# EasyEDA Pro project Modular-Analog-Synthesizer.eprj, board VCA-PCB
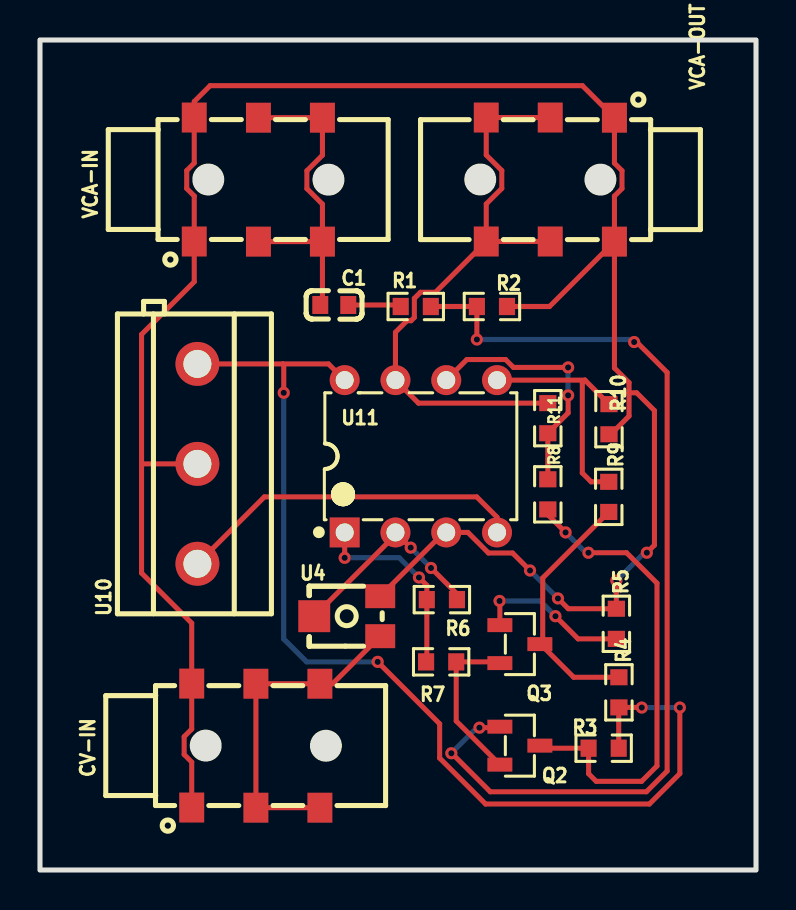
[diagram p9: board, top side]
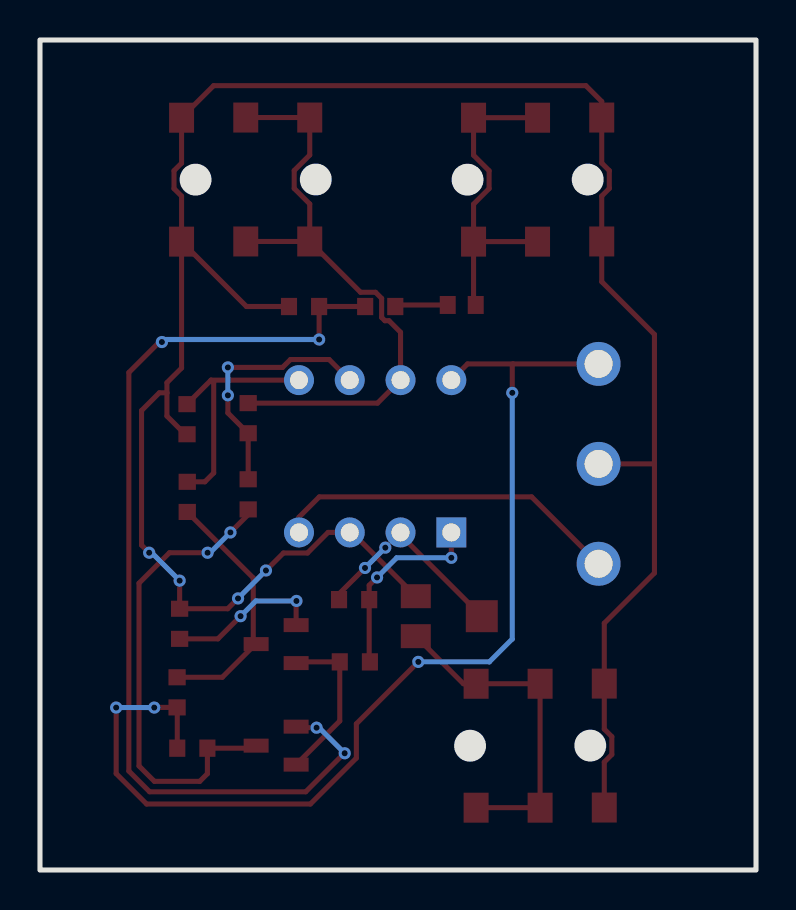
[diagram p10: board, bottom side, seen from below]

Outline 35.81 x 41.53 mm; copper layers: Top Layer, Bottom Layer. Coordinates in mm from the lower left corner of the outline.
Outline path: rectangle 0,41.53 35.81,0
Stack: Top Layer 0.035mm / Dielectric1 1.51mm FR4 er 4.5 / Bottom Layer 0.035mm

## Design rules (mm)
template: JLCPCB Capability(Two Layers Board)
spacing copperThickness1oz (default): track to track 0.102, other pairs 0.152 to 0.3
spacing copperThickness2oz: track to track 0.203, other pairs 0.152 to 0.3
track width copperThickness1oz (default): min 0.127, default 0.254, max 2.54
track width copperThickness2oz: min 0.203, default 0.254, max 2.54
differential pair differentialPair (default): width min 0.127, default 0.254, max 2.54; gap min 0.152, default 0.152
via viaSize (default): diameter min 0.5, default 0.61, max 10; hole min 0.3, default 0.305, max 6.3

## Placement (name value [footprint] x y rotation side)
C1  1μ  [C0603]  14.72 28.27 0 top
CV-IN  -  [AUDIO-SMD_PJ-313D]  10.79 6.22 90 top
Q2  NPN  [SOT-23-3_L2.9-W1.3-P1.90-LS2.4-BR]  24 6.22 180 top
Q3  NPN  [SOT-23-3_L2.9-W1.3-P1.90-LS2.4-BR]  24 11.3 180 top
R1  200K  [R0603]  18.8 28.19 0 top
R2  1K  [R0603]  22.61 28.19 180 top
R3  47k  [R0603]  28.19 6.1 0 top
R4  47k  [R0603]  28.96 8.89 270 top
R5  1K  [R0603]  28.83 12.32 90 top
R6  100K  [R0603]  20.1 13.53 180 top
R7  47k  [R0603]  20.07 10.41 180 top
R8  15K  [R0603]  25.4 18.8 90 top
R9  15K  [R0603]  28.45 18.67 90 top
R10  100K  [R0603]  28.46 22.56 90 top
R11  100K  [R0603]  25.4 22.61 90 top
U4  Pot-100k  [RES-ADJ-SMD_VG039NCH]  15.37 12.7 0 top
U10  -  [CONN-TH_3P-P5.00_KF301-5.0-3P]  7.87 20.32 90 top
U11  -  [DIP-8_L9.6-W6.4-P2.54-LS7.6-BL-1]  19.05 20.7 0 top
VCA-IN  -  [AUDIO-SMD_PJ-313D]  10.92 34.54 90 top
VCA-OUT  -  [AUDIO-SMD_PJ-313D]  25.53 34.54 270 top

## Footprints (pads in the part's own frame, mm; a bottom-side part is the same pattern mirrored in y, then rotated)
AUDIO-SMD_PJ-313D
  rect 1.501x1.25 smd: 1(-3.096,3.205) 1(3.104,3.205) 2(-3.104,-3.205) 2(3.096,-3.205) 3(-3.104,-0.005) 3(3.096,-0.005)
C0603
  rect 0.8x0.9 smd: 1(-0.7,0) 2(0.7,0)
CONN-TH_3P-P5.00_KF301-5.0-3P
  round 2.2 hole 1.399: 1(-4.998,0) 2(0,0) 3(5.002,0)
DIP-8_L9.6-W6.4-P2.54-LS7.6-BL-1
  rect 1.501x1.501 hole 0.899: 1(-3.81,-3.81)
  round 1.501 hole 0.899: 2(-1.27,-3.81) 3(1.27,-3.81) 4(3.81,-3.81) 5(3.81,3.81) 6(1.27,3.81) 7(-1.27,3.81) 8(-3.81,3.81)
R0603
  rect 0.806x0.864 smd: 1(-0.753,0) 2(0.753,0)
RES-ADJ-SMD_VG039NCH
  rect 1.5x1.2 smd: 1(1.65,-1) 3(1.65,1)
  rect 1.6x1.6 smd: 2(-1.65,0)
SOT-23-3_L2.9-W1.3-P1.90-LS2.4-BR
  rect 1.25x0.7 smd: 1(1,-0.95) 2(1,0.95) 3(-1,0)

## Nets
As in the schematic.

## Via types
v1: diameter 0.61, hole 0.305, Top Layer to Bottom Layer, 22 vias

## Routing (per net, layer and track width the routed paths; a pad name or vN(x,y) marks a point on that pad's centre or on a via; arc(x,y) is an arc through that point)
GND: length 113.7
  Top Layer w0.254: 5.08,20.32 5.08,26.8 7.72,29.43 VCA-IN.1 7.72,33.72 7.34,34.1 7.34,34.99 7.72,35.37 VCA-IN.1 7.72,38.45 8.51,39.24 27.13,39.24 VCA-OUT.1 28.73,35.37 29.11,34.99 29.11,34.09 28.73,33.72 VCA-OUT.1 ; 5.08,20.32 U10.2 ; 5.08,20.32 5.08,14.86 7.59,12.35 CV-IN.1 7.59,7.05 7.21,6.67 7.21,5.78 7.59,5.4 CV-IN.1 ; v1(24.51,14.99) 23.64,15.86 22.43,15.86 21.4,16.89 U11.3 20.21,16.89 U4.3 ; VCA-OUT.1 28.73,25.12 29.46,24.38 29.46,23.88 ; VCA-OUT.1 25.49,28.19 R2.1 ; R10.1 28.55,21.8 29.46,22.71 29.46,23.88 ; v1(28.83,14.48) R5.2 26.42,13.07 v1(25.91,13.59) ; 29.46,23.88 29.84,23.88 30.73,22.99 30.73,16.26 v1(30.35,15.88)
  Bottom Layer w0.254: v1(28.83,14.48) 30.23,15.88 v1(30.35,15.88) ; v1(24.51,14.99) v1(25.91,13.59)
VCC: length 54.7
  Top Layer w0.254: 12.16,25.32 12.19,25.29 v1(12.19,23.88) ; 12.16,25.32 U10.3 ; 12.16,25.32 14.43,25.32 U11.8 ; R3.2 28.95,8.13 R4.2 30.09,8.14 v1(30.1,8.13) ; v1(16.89,10.41) 19.99,7.31 19.99,5.6 22.29,3.3 30.48,3.3 32,4.83 v1(32,8.13)
  Bottom Layer w0.254: v1(16.89,10.41) 13.34,10.41 12.19,11.56 v1(12.19,23.88) ; v1(32,8.13) v1(30.1,8.13)
VEE: length 17.6
  Top Layer w0.254: U11.4 22.86,17.65 21.84,18.67 11.22,18.67 U10.1
$1N3465: length 49.1
  Top Layer w0.254: v1(20.57,5.84) 20.6,5.84 22.52,3.92 30.33,3.92 31.37,4.95 31.37,24.89 29.84,26.42 v1(29.72,26.42) ; Q2.1 22.95,7.12 v1(21.98,7.12) ; v1(21.85,26.54) R2.2 R1.2
  Bottom Layer w0.254: v1(21.85,26.54) 29.59,26.54 v1(29.72,26.42) ; v1(20.57,5.84) 21.85,7.12 v1(21.98,7.12)
$1N3675: length 8.3
  Top Layer w0.254: Q3.2 22.94,10.41 R7.1 20.82,7.46 Q2.2
$1N3966: length 16.6
  Top Layer w0.254: CV-IN.2 CV-IN.3 CV-IN.3 CV-IN.2 14.64,9.32 U4.1
$1N4074: length 10.5
  Top Layer w0.254: U4.2 17.78,16.76 U11.2 v1(18.54,16.13) ; v1(19.56,15.11) 20.86,13.82 R6.1
  Bottom Layer w0.254: v1(18.54,16.13) v1(19.56,15.11)
$1N4181: length 9.8
  Top Layer w0.254: v1(18.96,14.64) 19.35,14.24 R6.2 19.35,10.45 R7.2 ; U11.1 v1(15.24,15.62)
  Bottom Layer w0.254: v1(15.24,15.62) 17.97,15.62 v1(18.96,14.64)
$1N4282: length 7.8
  Top Layer w0.254: Q3.1 23,13.45 v1(22.99,13.46) ; v1(25.78,12.7) 26.92,11.57 R5.1
  Bottom Layer w0.254: v1(25.78,12.7) 25.02,13.46 v1(22.99,13.46)
$1N4493: length 12.7
  Top Layer w0.254: v1(26.42,23.75) 26.42,22.87 R11.1 R8.2 ; U11.6 21.35,25.54 23.29,25.54 23.68,25.15 v1(26.42,25.15)
  Bottom Layer w0.254: v1(26.42,25.15) v1(26.42,23.75)
$1N4498: length 24
  Top Layer w0.254: v1(27.43,15.88) 29.34,15.88 30.86,14.35 30.86,5.21 30.09,4.44 27.82,4.44 27.44,4.82 R3.1 25.13,6.1 Q2.3 ; v1(26.29,16.89) 25.4,17.78 R8.1
  Bottom Layer w0.254: v1(26.29,16.89) 27.31,15.88 v1(27.43,15.88)
$1N4525: length 12.3
  Top Layer w0.254: R9.2 27.57,19.42 27.13,19.86 27.13,24.38 27.26,24.51 ; 27.26,24.51 U11.5 ; 27.26,24.51 28.46,23.31
$1N4530: length 12.5
  Top Layer w0.254: R4.1 26.69,9.64 25.15,11.19 25.15,14.61 R9.1
$1N4641: length 30.7
  Top Layer w0.254: VCA-OUT.2 22.32,33.33 23.1,34.1 23.1,35 22.32,35.77 VCA-OUT.2 VCA-OUT.3 ; VCA-OUT.2 VCA-OUT.3 ; VCA-OUT.2 19.78,28.91 19.03,28.91 18.72,28.6 18.72,27.65 18.56,27.48 18.36,27.48 17.78,26.91 U11.7 18.93,23.36 R11.2
$1N5299: length 16.5
  Top Layer w0.254: VCA-IN.2 14.13,33.31 13.35,34.09 13.35,34.99 14.13,35.76 VCA-IN.2 VCA-IN.3 ; VCA-IN.2 VCA-IN.3 ; VCA-IN.2 14.13,28.38 C1.1
$1N5302: length 2.7
  Top Layer w0.254: R1.1 17.97,28.27 C1.2
